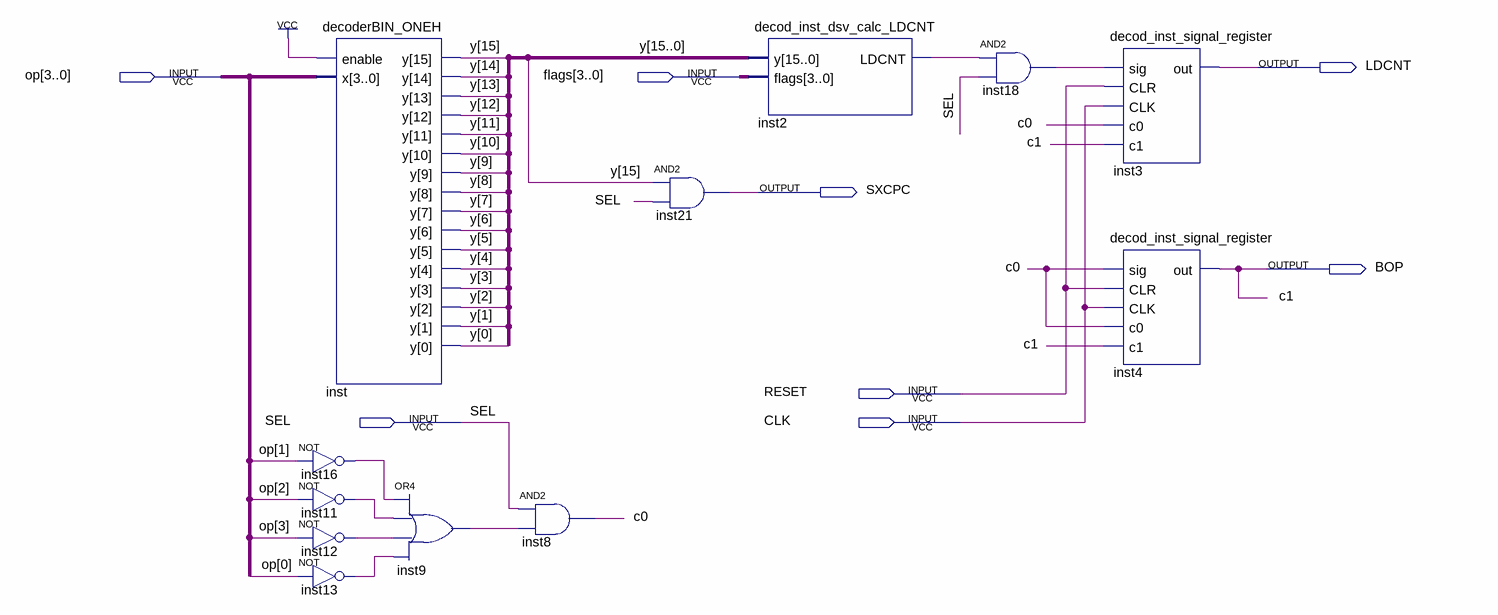
[diagram p0: schematic sheet]
// Quartus schematic decod_inst_dsv.bdf as structural Verilog: 12 symbols, 8 pins
module decod_inst_dsv (
  input  [3:0] op,
  input  [3:0] flags,
  input  RESET,
  input  SEL,
  input  CLK,
  output LDCNT,
  output SXCPC,
  output BOP
);

  wire c0, inst2_ldcnt, inst9_out, inst11_out, inst12_out, inst13_out, inst16_out, inst18_out;
  wire [15:0] y;

  decoderBIN_ONEH inst (.enable(1'b1), .x(op), .y(y));
  not inst16 (inst16_out, op[1]);
  not inst11 (inst11_out, op[2]);
  not inst12 (inst12_out, op[3]);
  not inst13 (inst13_out, op[0]);
  or inst9 (inst9_out, inst16_out, inst11_out, inst12_out, inst13_out);
  and inst8 (c0, SEL, inst9_out);
  and inst21 (SXCPC, y[15], SEL);
  decod_inst_dsv_calc_LDCNT inst2 (.y(y), .flags(flags), .LDCNT(inst2_ldcnt));
  and inst18 (inst18_out, inst2_ldcnt, SEL);
  decod_inst_signal_register inst3 (.sig(inst18_out), .CLR(RESET), .CLK(CLK), .c0(c0), .c1(BOP), .out(LDCNT));
  decod_inst_signal_register inst4 (.sig(c0), .CLR(RESET), .CLK(CLK), .c0(c0), .c1(BOP), .out(BOP));

  // Other names for the same wires on the sheet: c1 = BOP
endmodule
